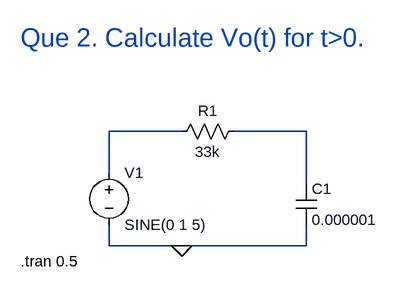
[diagram p0: schematic 2_Dheerendra_23EE019_AC_Transient.asc]
2_Dheerendra_23EE019_AC_Transient.asc, the LTspice schematic file:
Version 4
SHEET 1 880 680
WIRE 128 96 16 96
WIRE 320 96 208 96
WIRE 16 160 16 96
WIRE 320 176 320 96
WIRE 16 272 16 240
WIRE 128 272 16 272
WIRE 320 272 320 240
WIRE 320 272 128 272
FLAG 128 272 0
SYMBOL res 224 80 R90
WINDOW 0 0 56 VBottom 2
WINDOW 3 32 56 VTop 2
SYMATTR InstName R1
SYMATTR Value 33k
SYMBOL cap 304 176 R0
SYMATTR InstName C1
SYMATTR Value 0.000001
SYMBOL voltage 16 144 R0
WINDOW 123 0 0 Left 0
WINDOW 39 0 0 Left 0
SYMATTR InstName V1
SYMATTR Value SINE(0 1 5)
TEXT -120 -48 Left 4 ;Que 2. Calculate Vo(t) for t>0.
TEXT -120 296 Left 2 !.tran 0.5

The netlist it stands for:
* 2_Dheerendra_23EE019_AC_Transient.asc
R1 N002 N001 33k
C1 N002 0 0.000001
V1 N001 0 SINE(0 1 5)
* Que 2. Calculate Vo(t) for t>0.
.tran 0.5
.backanno
.end